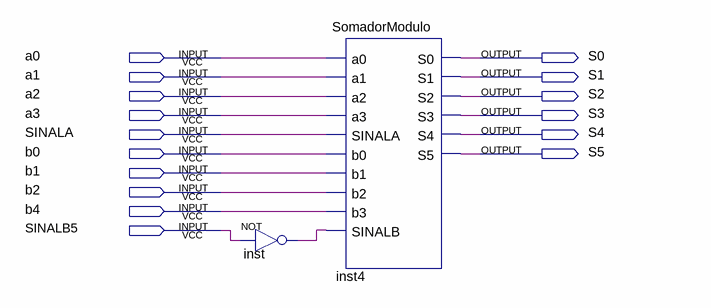
[diagram p0: schematic sheet]
// Quartus schematic SubtratorCompleto.bdf as structural Verilog: 2 symbols, 16 pins
module SubtratorCompleto (
  input  a0,
  input  a1,
  input  a2,
  input  a3,
  input  SINALA,
  input  b0,
  input  b1,
  input  b2,
  input  b4,
  input  SINALB5,
  output S0,
  output S1,
  output S2,
  output S3,
  output S4,
  output S5
);

  wire inst_out;

  not inst (inst_out, SINALB5);
  SomadorModulo inst4 (
    .a0(a0), .a1(a1), .a2(a2), .a3(a3), .SINALA(SINALA), .b0(b0), .b1(b1), .b2(b2), .b3(b4),
    .SINALB(inst_out), .S0(S0), .S1(S1), .S2(S2), .S3(S3), .S4(S4), .S5(S5));
endmodule
